# Altium project USBC_Charger.PrjPcb
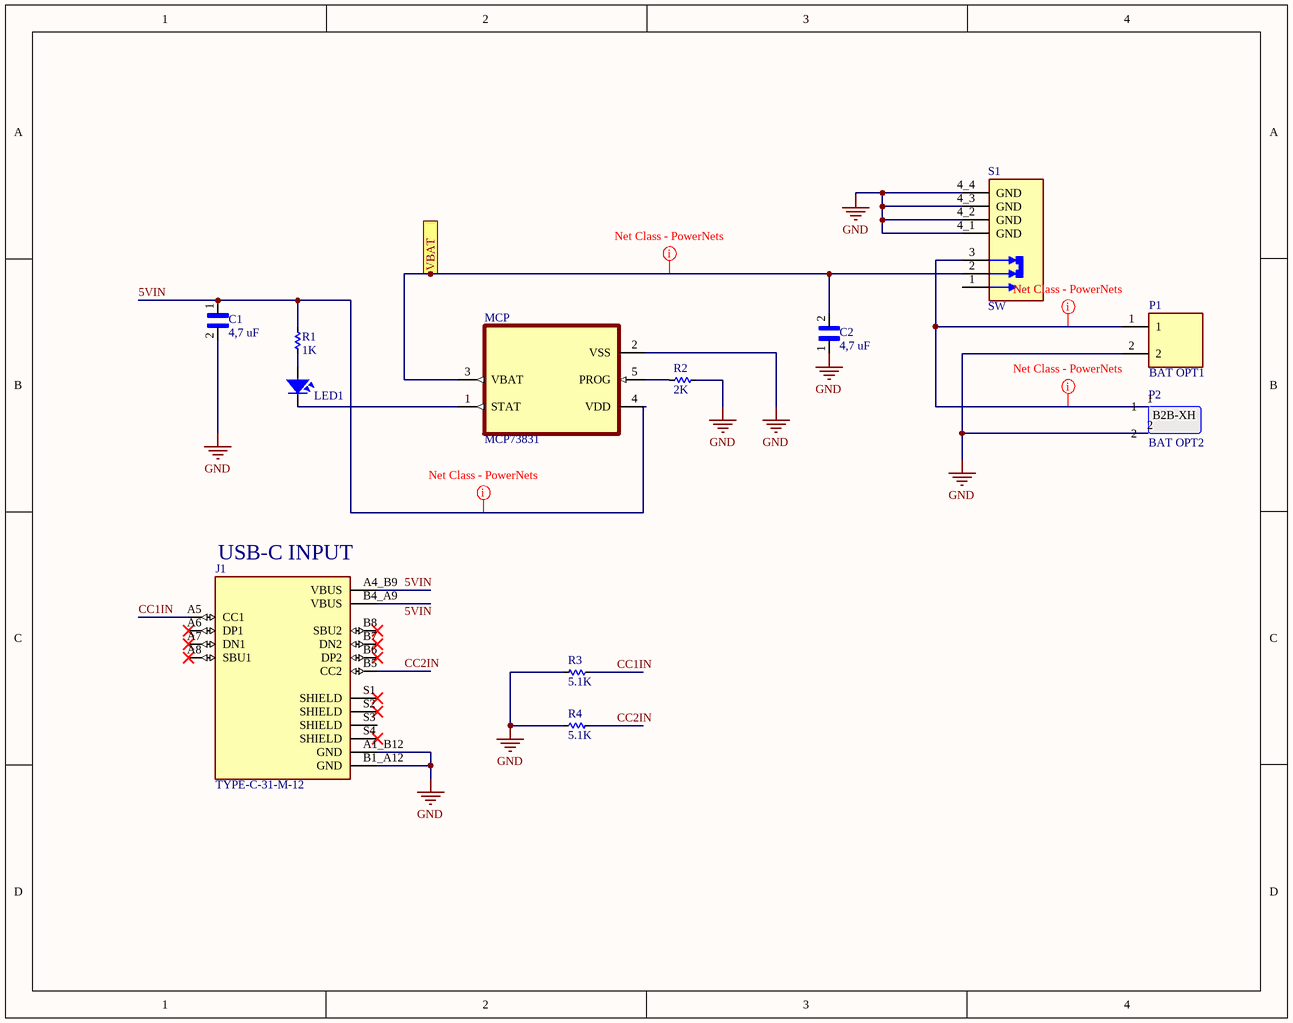
[diagram p0: Sheet1_ChargeManagementControllers.SchDoc]
2 sheets, 30 parts. Net scope: flat (ports and power ports of the same name join across sheets).
Board file: PortableCharger.PcbDoc
Sheets:
  Sheet1_ChargeManagementControllers.SchDoc
  Sheet2_StepUpDCDCConverter.SchDoc

## Sheet Sheet1_ChargeManagementControllers.SchDoc
size A

### Parts
C1  4,7 uF  [CAPC2012X150N]
C2  4,7 uF  [CAPC2012X150N]
J1  TYPE-C-31-M-12  [HRO_TYPE-C-31-M-12]
LED1  LED  [LED-0805-Red]  (value not drawn)
MCP  MCP73831  [SOT95P280X145-5N]
P1  BAT OPT1  [HANDSON_KF301-2P]
P2  BAT OPT2  [JST_B2B-XH-A]
R1  1K  [RES-SMD-0805]
R2  2K  [RES-SMD-0805]
R3  5.1K  [RES-SMD-0805]
R4  5.1K  [RES-SMD-0805]
S1  SW  [SW_MSK12C02]

### Ports
VBAT

### Nets
GND: C1.2 C2.1 J1.A1_B12(GND) J1.B1_A12(GND) MCP.2(VSS) P1.2 P2.2 R2.2 R3.2 R4.2 S1.4_1(GND) S1.4_2(GND) S1.4_3(GND) S1.4_4(GND)
5VIN: C1.1 J1.A4_B9(VBUS) MCP.4(VDD) R1.2
CC1IN: J1.A5(CC1) R3.1
CC2IN: J1.B5(CC2) R4.1
NetC2_2: C2.2 MCP.3(VBAT) S1.2 ; port VBAT
NetLED1_1: LED1.1 R1.1
NetLED1_2: LED1.2 MCP.1(STAT)
NetMCP_5: MCP.5(PROG) R2.1
NetP1_1: P1.1 P2.1 S1.3

Not connected (* = marked no-connect by the designer): J1 A6(DP1)* A7(DN1)* A8(SBU1)* B4_A9(VBUS) B6(DP2)* B7(DN2)* B8(SBU2)* S1(SHIELD)* S2(SHIELD)* S3(SHIELD) S4(SHIELD)*; S1 1

### Layout directives
net class PowerNets: 5VIN
mark named Net Class - PowerNets: NetC2_2, NetP1_1

### Notes on the sheet
- (near J1) USB-C INPUT
- Labels drawn without touching a wire or pin: 5VIN
- (in symbol B2B-XH-A) B2B-XH

### Library data of the parts
C1 C2 = C2012X7R1V475M125AE: Cap Ceramic 4.7uF 35V X7R 20% SMD 0805 125C T/R; MP: altium_native_batch; Value: *; Price: None; Availability: Unavailable; Package: None
J1 = TYPE-C-31-M-12: USB Connectors 24 Receptacle 1 8.94*7.3mm RoHS; MF: HRO Electronics Co., Ltd.; SnapEDA_Link: https://www.snapeda.com/parts/TYPE-C-31-M-12/HRO+Electronics+Co.%252C+Ltd./view-part/?ref=snap; Package: Package; Value: *; MP: TYPE-C-31-M-12; Check_prices: https://www.snapeda.com/parts/TYPE-C-31-M-12/HRO+Electronics+Co.%252C+Ltd./view-part/?ref=eda
LED1 = LED SMD: Value: LED 3 - 5 ly 2 Colour
MCP = MCP73831T-2ACI/OT: Charger IC Lithium Ion/Polymer SOT-23-5; MF: Microchip; Package: SOT-23 Microchip; Purchase-URL: https://pricing.snapeda.com/search/part/MCP73831T-2ACI/OT/?ref=eda; MP: MCP73831T-2ACI/OT; Value: *; Availability: In Stock; SnapEDA_Link: https://www.snapeda.com/parts/MCP73831T-2ACI/OT/Microchip/view-part/?ref=snap; Price: None; Check_prices: https://www.snapeda.com/parts/MCP73831T-2ACI/OT/Microchip/view-part/?ref=eda
P1 = KF301-2P: 2 Pin Terminal Block 5mm Pitch; MF: Handson Technology; SnapEDA_Link: https://www.snapeda.com/parts/KF301-2P/Handson+Technology/view-part/?ref=snap; Package: None; Value: *; MP: KF301-2P; Check_prices: https://www.snapeda.com/parts/KF301-2P/Handson+Technology/view-part/?ref=eda
P2 = B2B-XH-A
R1-R4 = Res-SMD: Resistor; Manufacturer: Generic Components; Class: Passive; Published: 08/06/2000; Publisher: Altium Hobart Technology Centre
S1 = MSK12C02: Package: None; Price: None; Value: *; MP: MSK12C02; Availability: Unavailable

## Sheet Sheet2_StepUpDCDCConverter.SchDoc
size A
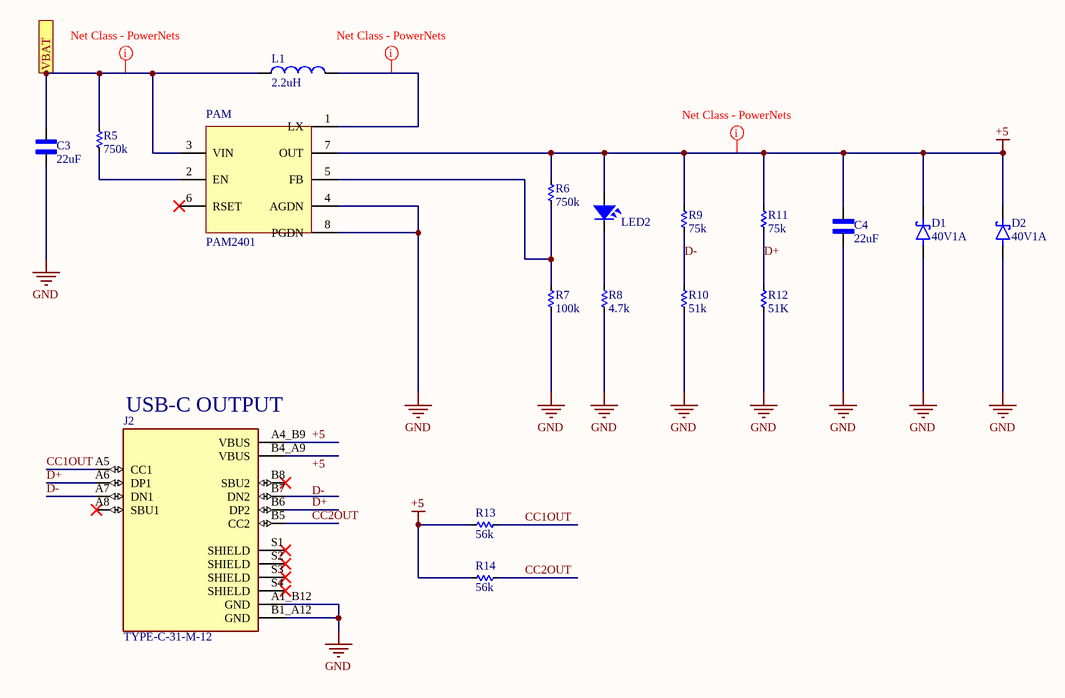
[diagram p1: Sheet2_StepUpDCDCConverter.SchDoc]

### Parts
C3  22uF  [CAPC2012X140N]
C4  22uF  [CAPC2012X140N]
D1  40V1A  [DIOM4326X240N]
D2  40V1A  [DIOM4326X240N]
J2  TYPE-C-31-M-12  [HRO_TYPE-C-31-M-12]
L1  2.2uH  [INDC2520X100N]
LED2  LED  [LED-0805-Red]  (value not drawn)
PAM  PAM2401  [TSOP65P490X110-8N]
R5  750k  [RES-SMD-0805]
R6  750k  [RES-SMD-0805]
R7  100k  [RES-SMD-0805]
R8  4.7k  [RES-SMD-0805]
R9  75k  [RES-SMD-0805]
R10  51k  [RES-SMD-0805]
R11  75k  [RES-SMD-0805]
R12  51K  [RES-SMD-0805]
R13  56k  [RES-SMD-0805]
R14  56k  [RES-SMD-0805]

### Ports
VBAT

### Nets
+5: C4.2 D1.C(K) D2.C(K) J2.A4_B9(VBUS) LED2.1 PAM.7(OUT) R6.1 R9.1 R11.1 R13.2 R14.2
GND: C3.1 C4.1 D1.A D2.A J2.A1_B12(GND) J2.B1_A12(GND) PAM.4(AGDN) PAM.8(PGDN) R7.2 R8.2 R10.2 R12.2
CC1OUT: J2.A5(CC1) R13.1
CC2OUT: J2.B5(CC2) R14.1
D+: J2.A6(DP1) J2.B6(DP2) R11.2 R12.1
D-: J2.A7(DN1) R9.2 R10.1
NetC2_2: C3.2 L1.1 PAM.3(VIN) R5.1 ; port VBAT
NetL1_2: L1.2 PAM.1(LX)
NetLED2_2: LED2.2 R8.1
NetPAM_2: PAM.2(EN) R5.2
NetPAM_5: PAM.5(FB) R6.2 R7.1

Not connected (* = marked no-connect by the designer): J2 A8(SBU1)* B4_A9(VBUS) B7(DN2) B8(SBU2)* S1(SHIELD)* S2(SHIELD)* S3(SHIELD)* S4(SHIELD)*; PAM 6(RSET)*

### Layout directives
net class PowerNets: NetC2_2, NetL1_2
mark named Net Class - PowerNets: +5

### Notes on the sheet
- (near J2) USB-C OUTPUT
- Labels drawn without touching a wire or pin: +5, D-

### Library data of the parts
C3 C4 = GRM21BR60J226ME39K: SMD capacitor X5R(EIA) with capacitance 22uF Tol.20%. Rated voltage 6.3Vdc 85C; MF: Murata Electronics; SnapEDA_Link: https://www.snapeda.com/parts/GRM21BR60J226ME39K/Murata+Electronics+North+America/view-part/?ref=snap; Package: 2012 Murata; Value: *; MP: GRM21BR60J226ME39K; Check_prices: https://www.snapeda.com/parts/GRM21BR60J226ME39K/Murata+Electronics+North+America/view-part/?ref=eda
D1 D2 = B140-13-F: Schottky Diode 1A 40V 0.5Vf SMA | Diodes Inc B140-13-F; MF: Diodes Inc.; SnapEDA_Link: https://www.snapeda.com/parts/B140-13-F/Diodes+Inc./view-part/?ref=snap; Package: DO-214 Diodes Inc.; Value: *; MP: B140-13-F; Check_prices: https://www.snapeda.com/parts/B140-13-F/Diodes+Inc./view-part/?ref=eda
J2 = TYPE-C-31-M-12: as J1 on sheet Sheet1_ChargeManagementControllers; SnapEDA_Link: https://www.snapeda.com/parts/TYPE-C-31-M-12/HRO+Electronics+Co.%252C+Ltd./view-part/?ref=snap; Package: Package; Value: *; MP: TYPE-C-31-M-12; Check_prices: https://www.snapeda.com/parts/TYPE-C-31-M-12/HRO+Electronics+Co.%252C+Ltd./view-part/?ref=eda
L1 = LQM2HPN2R2MGSL: Inductor with Inductance: 2.2uH Tol. +/-20%, Package: 1008 (2520); MF: Murata; Price: None; Value: *; Check_prices: https://www.snapeda.com/parts/LQM2HPN2R2MGSL/Murata/view-part/1514108/?ref=eda; Package: 2520 Murata; SnapEDA_Link: https://www.snapeda.com/parts/LQM2HPN2R2MGSL/Murata/view-part/1514108/?ref=snap; Purchase-URL: https://pricing.snapeda.com/search/part/LQM2HPN2R2MGSL/?ref=eda; Availability: In Stock; MP: LQM2HPN2R2MGSL
LED2 = LED SMD: Value: LED 3 - 5 ly 2 Colour
R5-R14 = Res-SMD: as R1 on sheet Sheet1_ChargeManagementControllers; Published: 08/06/2000; Publisher: Altium Hobart Technology Centre

## Nets that join several sheets
GND: Sheet1_ChargeManagementControllers (14 pins), Sheet2_StepUpDCDCConverter (12 pins)
NetC2_2: Sheet1_ChargeManagementControllers (C2.2 MCP.3 S1.2), Sheet2_StepUpDCDCConverter (C3.2 L1.1 PAM.3 R5.1)